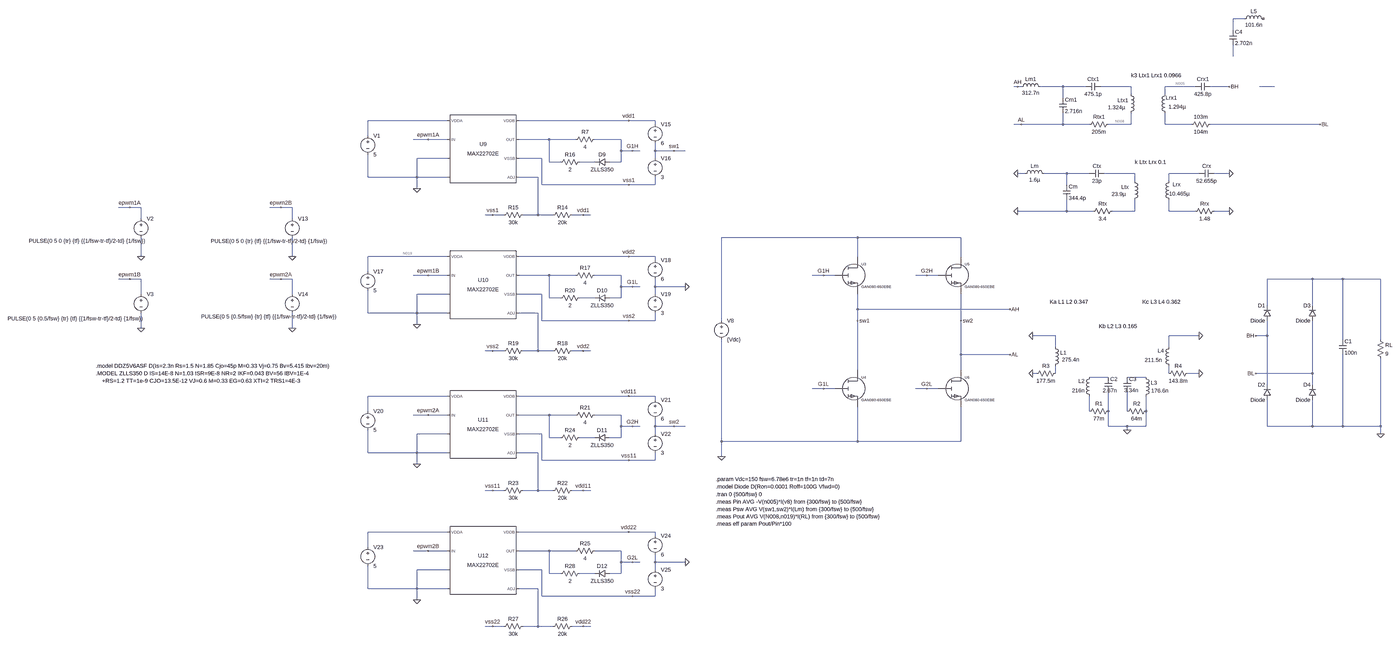
[diagram p0: schematic 1kW_LCCLS_sim.asc, whole sheet]
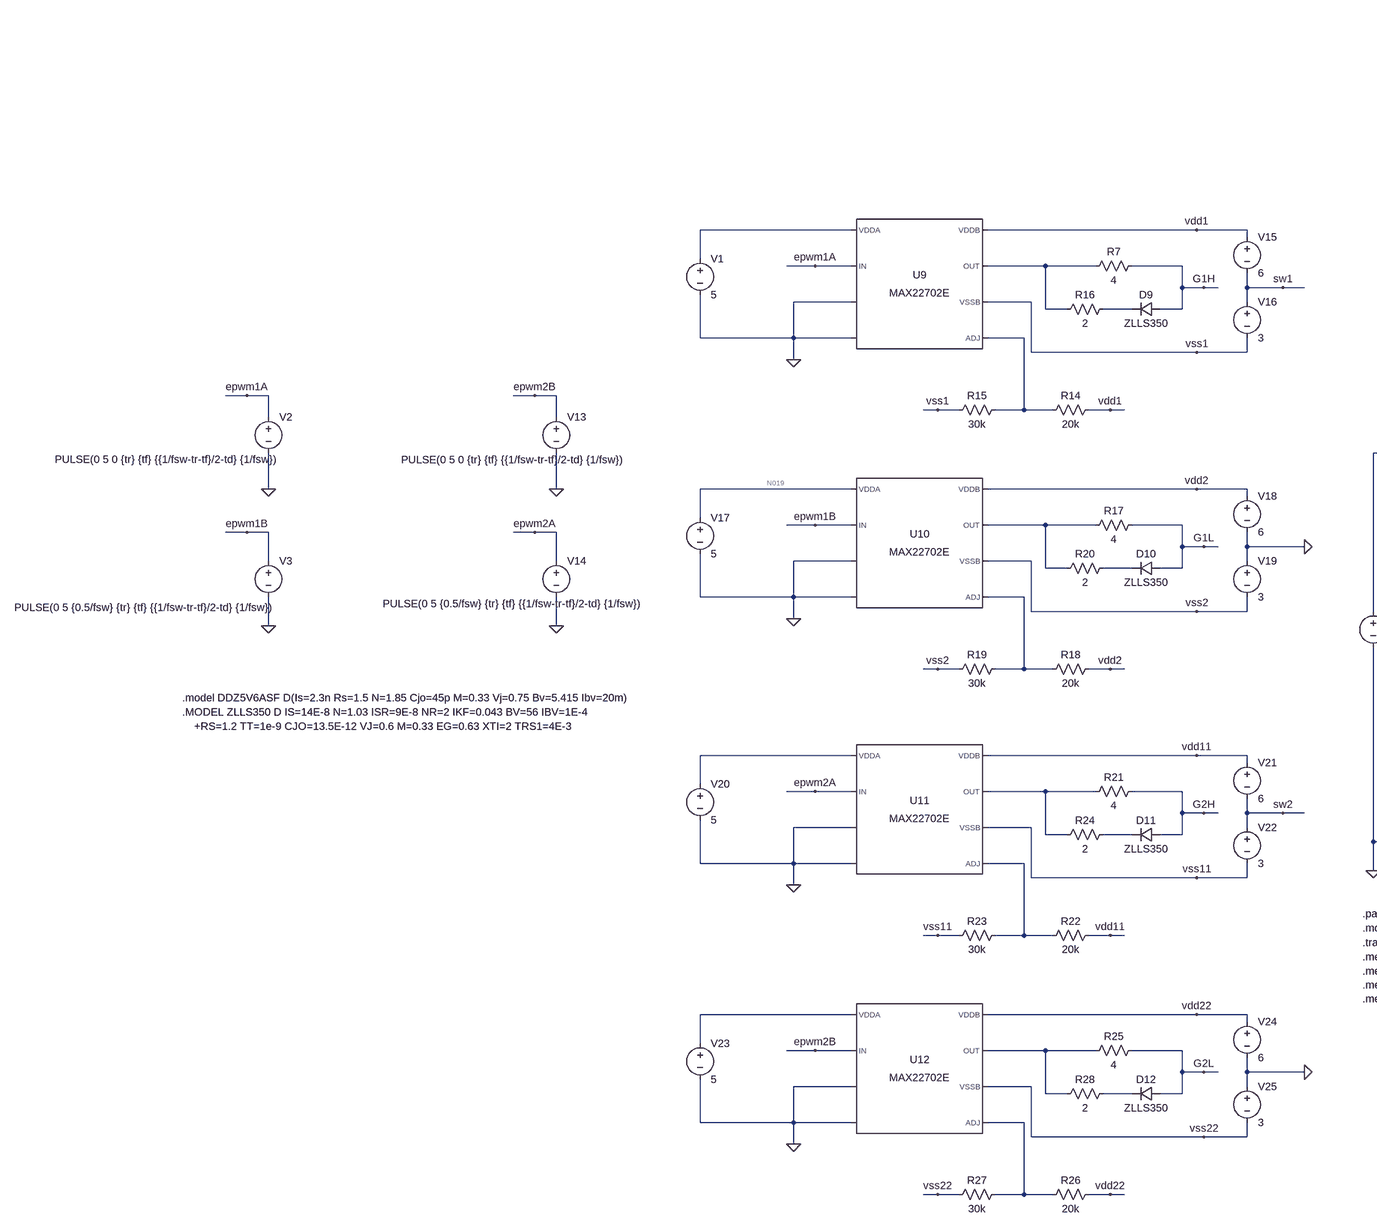
[diagram p1: schematic 1kW_LCCLS_sim.asc, part, row 1 of 1, column 1 of 2]
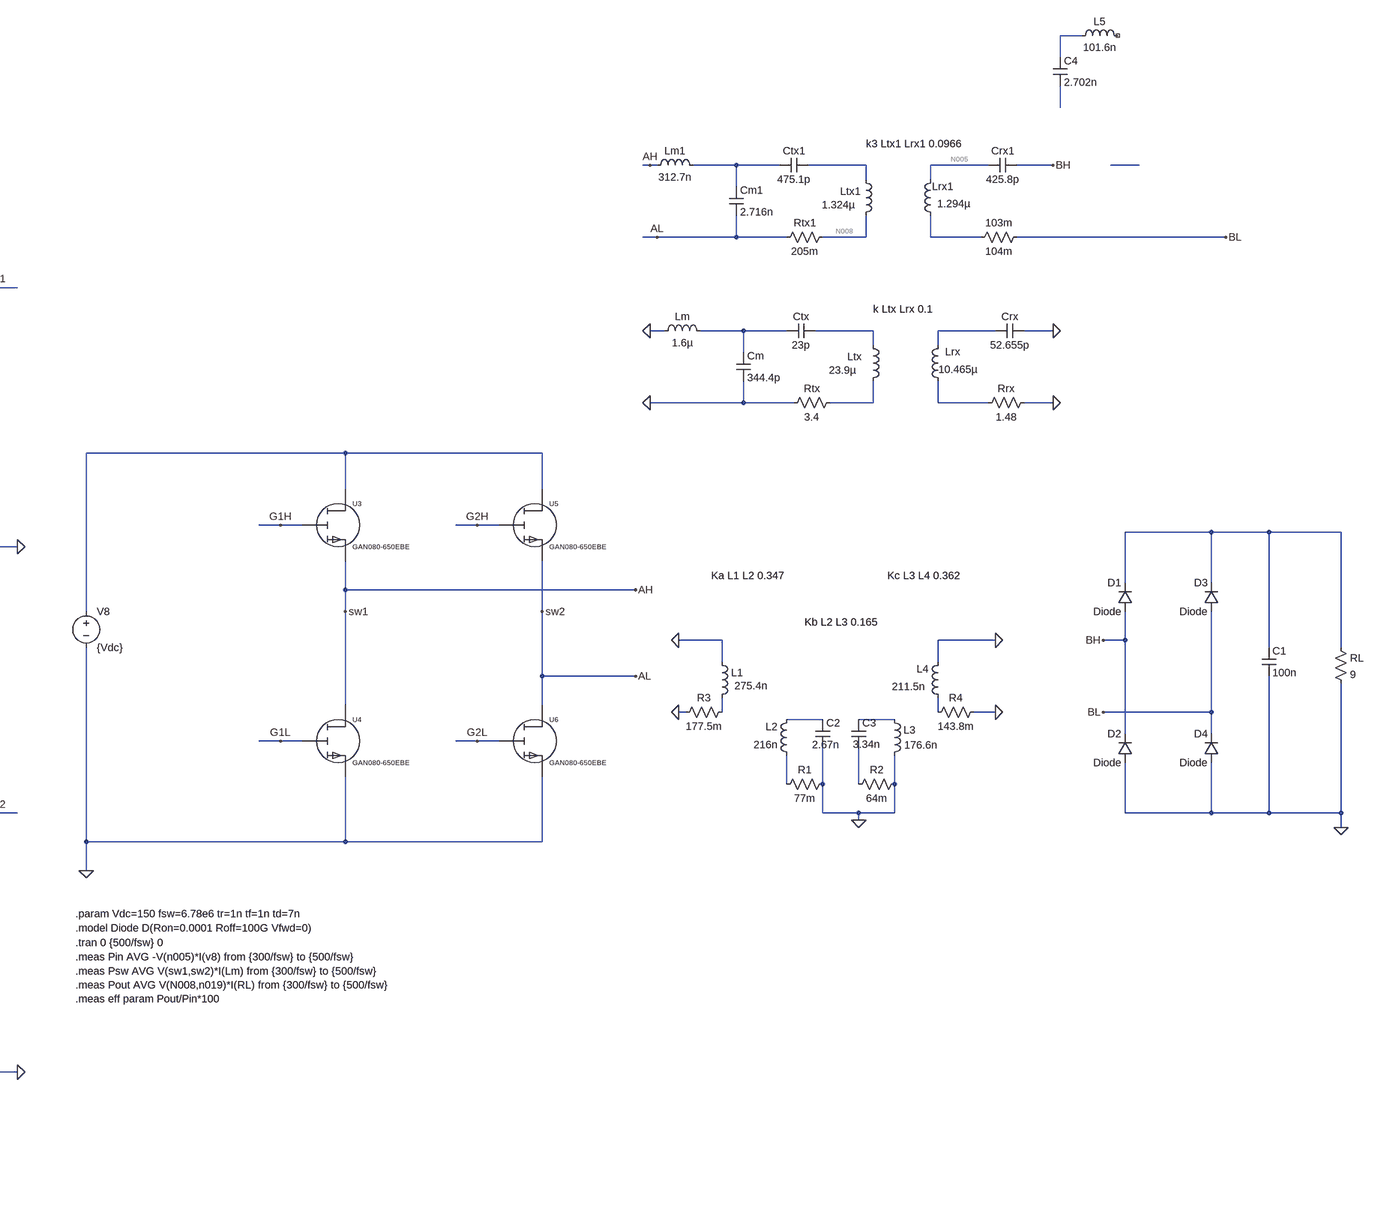
[diagram p2: schematic 1kW_LCCLS_sim.asc, part, row 1 of 1, column 2 of 2]
1kW_LCCLS_sim.asc, the LTspice schematic file:
Version 4.1
SHEET 1 2440 680
WIRE 1584 -4624 1536 -4624
WIRE 1536 -4576 1536 -4624
WIRE 1536 -4464 1536 -4512
WIRE 624 -4336 608 -4336
WIRE 640 -4336 624 -4336
WIRE 816 -4336 720 -4336
WIRE 912 -4336 816 -4336
WIRE 1104 -4336 976 -4336
WIRE 1376 -4336 1248 -4336
WIRE 1520 -4336 1440 -4336
WIRE 1712 -4336 1648 -4336
WIRE 1104 -4304 1104 -4336
WIRE 1248 -4304 1248 -4336
WIRE 816 -4288 816 -4336
WIRE -2160 -4192 -2496 -4192
WIRE -1392 -4192 -1856 -4192
WIRE -1280 -4192 -1392 -4192
WIRE -1280 -4176 -1280 -4192
WIRE 640 -4176 608 -4176
WIRE 816 -4176 816 -4224
WIRE 816 -4176 640 -4176
WIRE 928 -4176 816 -4176
WIRE 1104 -4176 1104 -4224
WIRE 1104 -4176 1008 -4176
WIRE 1248 -4176 1248 -4224
WIRE 1360 -4176 1248 -4176
WIRE 1904 -4176 1440 -4176
WIRE -2496 -4128 -2496 -4192
WIRE -2240 -4112 -2304 -4112
WIRE -2160 -4112 -2240 -4112
WIRE -1728 -4112 -1856 -4112
WIRE -1616 -4112 -1728 -4112
WIRE -1424 -4112 -1536 -4112
WIRE -1424 -4064 -1424 -4112
WIRE -1376 -4064 -1424 -4064
WIRE -1344 -4064 -1376 -4064
WIRE -1280 -4064 -1280 -4096
WIRE -1200 -4064 -1280 -4064
WIRE -1152 -4064 -1200 -4064
WIRE -2160 -4032 -2288 -4032
WIRE -1760 -4032 -1856 -4032
WIRE -1280 -4032 -1280 -4064
WIRE -1728 -4016 -1728 -4112
WIRE -1680 -4016 -1728 -4016
WIRE -1536 -4016 -1600 -4016
WIRE -1424 -4016 -1424 -4064
WIRE -1424 -4016 -1472 -4016
WIRE 656 -3968 624 -3968
WIRE 832 -3968 736 -3968
WIRE 928 -3968 832 -3968
WIRE 1120 -3968 992 -3968
WIRE 1392 -3968 1264 -3968
WIRE 1520 -3968 1456 -3968
WIRE -2496 -3952 -2496 -4048
WIRE -2288 -3952 -2288 -4032
WIRE -2288 -3952 -2496 -3952
WIRE -2160 -3952 -2288 -3952
WIRE -1776 -3952 -1856 -3952
WIRE 1120 -3936 1120 -3968
WIRE 1264 -3936 1264 -3968
WIRE -1760 -3920 -1760 -4032
WIRE -1392 -3920 -1760 -3920
WIRE -1280 -3920 -1280 -3952
WIRE -1280 -3920 -1392 -3920
WIRE 832 -3920 832 -3968
WIRE -2288 -3904 -2288 -3952
WIRE -3872 -3824 -3920 -3824
WIRE -3824 -3824 -3872 -3824
WIRE -3232 -3824 -3280 -3824
WIRE -3184 -3824 -3232 -3824
WIRE 832 -3808 832 -3856
WIRE 832 -3808 624 -3808
WIRE 944 -3808 832 -3808
WIRE 1120 -3808 1120 -3856
WIRE 1120 -3808 1024 -3808
WIRE 1264 -3808 1264 -3856
WIRE 1376 -3808 1264 -3808
WIRE 1520 -3808 1456 -3808
WIRE -1968 -3792 -2000 -3792
WIRE -1920 -3792 -1968 -3792
WIRE -1776 -3792 -1776 -3952
WIRE -1776 -3792 -1840 -3792
WIRE -1712 -3792 -1776 -3792
WIRE -1584 -3792 -1632 -3792
WIRE -1552 -3792 -1584 -3792
WIRE -3824 -3776 -3824 -3824
WIRE -3184 -3776 -3184 -3824
WIRE -160 -3696 -736 -3696
WIRE 384 -3696 -160 -3696
WIRE -3824 -3616 -3824 -3696
WIRE -3184 -3616 -3184 -3696
WIRE -2160 -3616 -2496 -3616
WIRE -1392 -3616 -1856 -3616
WIRE -1280 -3616 -1392 -3616
WIRE -160 -3616 -160 -3696
WIRE 384 -3616 384 -3696
WIRE -1280 -3600 -1280 -3616
WIRE -2496 -3552 -2496 -3616
WIRE -2240 -3536 -2304 -3536
WIRE -2160 -3536 -2240 -3536
WIRE -1728 -3536 -1856 -3536
WIRE -1616 -3536 -1728 -3536
WIRE -1424 -3536 -1536 -3536
WIRE -304 -3536 -352 -3536
WIRE -256 -3536 -304 -3536
WIRE 240 -3536 192 -3536
WIRE 288 -3536 240 -3536
WIRE -3872 -3520 -3920 -3520
WIRE -3824 -3520 -3872 -3520
WIRE -3232 -3520 -3280 -3520
WIRE -3184 -3520 -3232 -3520
WIRE 1872 -3520 1680 -3520
WIRE 2000 -3520 1872 -3520
WIRE 2160 -3520 2000 -3520
WIRE -1424 -3488 -1424 -3536
WIRE -1376 -3488 -1424 -3488
WIRE -1344 -3488 -1376 -3488
WIRE -1280 -3488 -1280 -3520
WIRE -1152 -3488 -1280 -3488
WIRE -3824 -3456 -3824 -3520
WIRE -3184 -3456 -3184 -3520
WIRE -2160 -3456 -2288 -3456
WIRE -1760 -3456 -1856 -3456
WIRE -1280 -3456 -1280 -3488
WIRE -1728 -3440 -1728 -3536
WIRE -1680 -3440 -1728 -3440
WIRE -1536 -3440 -1600 -3440
WIRE -1424 -3440 -1424 -3488
WIRE -1424 -3440 -1472 -3440
WIRE 1680 -3408 1680 -3520
WIRE 1872 -3408 1872 -3520
WIRE -160 -3392 -160 -3456
WIRE 592 -3392 -160 -3392
WIRE -2496 -3376 -2496 -3472
WIRE -2288 -3376 -2288 -3456
WIRE -2288 -3376 -2496 -3376
WIRE -2160 -3376 -2288 -3376
WIRE -1776 -3376 -1856 -3376
WIRE -1760 -3344 -1760 -3456
WIRE -1392 -3344 -1760 -3344
WIRE -1280 -3344 -1280 -3376
WIRE -1280 -3344 -1392 -3344
WIRE -736 -3344 -736 -3696
WIRE -160 -3344 -160 -3392
WIRE 384 -3344 384 -3456
WIRE -2288 -3328 -2288 -3376
WIRE -3824 -3312 -3824 -3376
WIRE -3184 -3312 -3184 -3376
WIRE 784 -3280 688 -3280
WIRE 1392 -3280 1264 -3280
WIRE 1680 -3280 1680 -3344
WIRE 1680 -3280 1632 -3280
WIRE 2000 -3264 2000 -3520
WIRE 2160 -3264 2160 -3520
WIRE 784 -3232 784 -3280
WIRE 1264 -3232 1264 -3280
WIRE -1968 -3216 -2000 -3216
WIRE -1920 -3216 -1968 -3216
WIRE -1776 -3216 -1776 -3376
WIRE -1776 -3216 -1840 -3216
WIRE -1712 -3216 -1776 -3216
WIRE -1584 -3216 -1632 -3216
WIRE -1552 -3216 -1584 -3216
WIRE 384 -3200 384 -3344
WIRE 592 -3200 384 -3200
WIRE -160 -3136 -160 -3344
WIRE 384 -3136 384 -3200
WIRE 704 -3120 688 -3120
WIRE 784 -3120 784 -3152
WIRE 1264 -3120 1264 -3152
WIRE 1392 -3120 1344 -3120
WIRE 1872 -3120 1872 -3344
WIRE 1872 -3120 1632 -3120
WIRE 1008 -3104 928 -3104
WIRE 1168 -3104 1088 -3104
WIRE 1680 -3072 1680 -3280
WIRE 1872 -3072 1872 -3120
WIRE -304 -3056 -352 -3056
WIRE -256 -3056 -304 -3056
WIRE 240 -3056 192 -3056
WIRE 288 -3056 240 -3056
WIRE -2160 -3024 -2496 -3024
WIRE -1392 -3024 -1856 -3024
WIRE -1280 -3024 -1392 -3024
WIRE -1280 -3008 -1280 -3024
WIRE -2496 -2960 -2496 -3024
WIRE 928 -2960 928 -3024
WIRE 1008 -2960 1008 -3040
WIRE 1088 -2960 1088 -3040
WIRE 1168 -2960 1168 -3024
WIRE -2240 -2944 -2304 -2944
WIRE -2160 -2944 -2240 -2944
WIRE -1728 -2944 -1856 -2944
WIRE -1616 -2944 -1728 -2944
WIRE -1424 -2944 -1536 -2944
WIRE -1424 -2896 -1424 -2944
WIRE -1376 -2896 -1424 -2896
WIRE -1344 -2896 -1376 -2896
WIRE -1280 -2896 -1280 -2928
WIRE -1200 -2896 -1280 -2896
WIRE -1152 -2896 -1200 -2896
WIRE 1008 -2896 1008 -2960
WIRE 1088 -2896 1008 -2896
WIRE 1168 -2896 1168 -2960
WIRE 1168 -2896 1088 -2896
WIRE 1680 -2896 1680 -3008
WIRE 1872 -2896 1872 -3008
WIRE 1872 -2896 1680 -2896
WIRE 2000 -2896 2000 -3200
WIRE 2000 -2896 1872 -2896
WIRE 2160 -2896 2160 -3184
WIRE 2160 -2896 2000 -2896
WIRE 1088 -2880 1088 -2896
WIRE -2160 -2864 -2288 -2864
WIRE -1760 -2864 -1856 -2864
WIRE -1280 -2864 -1280 -2896
WIRE 2160 -2864 2160 -2896
WIRE -1728 -2848 -1728 -2944
WIRE -1680 -2848 -1728 -2848
WIRE -1536 -2848 -1600 -2848
WIRE -1424 -2848 -1424 -2896
WIRE -1424 -2848 -1472 -2848
WIRE -736 -2832 -736 -3264
WIRE -160 -2832 -160 -2976
WIRE -160 -2832 -736 -2832
WIRE 384 -2832 384 -2976
WIRE 384 -2832 -160 -2832
WIRE -2496 -2784 -2496 -2880
WIRE -2288 -2784 -2288 -2864
WIRE -2288 -2784 -2496 -2784
WIRE -2160 -2784 -2288 -2784
WIRE -1776 -2784 -1856 -2784
WIRE -736 -2768 -736 -2832
WIRE -1760 -2752 -1760 -2864
WIRE -1392 -2752 -1760 -2752
WIRE -1280 -2752 -1280 -2784
WIRE -1280 -2752 -1392 -2752
WIRE -2288 -2736 -2288 -2784
WIRE -1968 -2624 -2000 -2624
WIRE -1920 -2624 -1968 -2624
WIRE -1776 -2624 -1776 -2784
WIRE -1776 -2624 -1840 -2624
WIRE -1712 -2624 -1776 -2624
WIRE -1584 -2624 -1632 -2624
WIRE -1552 -2624 -1584 -2624
WIRE -2160 -2448 -2496 -2448
WIRE -1392 -2448 -1856 -2448
WIRE -1280 -2448 -1392 -2448
WIRE -1280 -2432 -1280 -2448
WIRE -2496 -2384 -2496 -2448
WIRE -2240 -2368 -2304 -2368
WIRE -2160 -2368 -2240 -2368
WIRE -1728 -2368 -1856 -2368
WIRE -1616 -2368 -1728 -2368
WIRE -1424 -2368 -1536 -2368
WIRE -1424 -2320 -1424 -2368
WIRE -1376 -2320 -1424 -2320
WIRE -1344 -2320 -1376 -2320
WIRE -1280 -2320 -1280 -2352
WIRE -1152 -2320 -1280 -2320
WIRE -2160 -2288 -2288 -2288
WIRE -1760 -2288 -1856 -2288
WIRE -1280 -2288 -1280 -2320
WIRE -1728 -2272 -1728 -2368
WIRE -1680 -2272 -1728 -2272
WIRE -1536 -2272 -1600 -2272
WIRE -1424 -2272 -1424 -2320
WIRE -1424 -2272 -1472 -2272
WIRE -2496 -2208 -2496 -2304
WIRE -2288 -2208 -2288 -2288
WIRE -2288 -2208 -2496 -2208
WIRE -2160 -2208 -2288 -2208
WIRE -1776 -2208 -1856 -2208
WIRE -1760 -2176 -1760 -2288
WIRE -1376 -2176 -1760 -2176
WIRE -1280 -2176 -1280 -2208
WIRE -1280 -2176 -1376 -2176
WIRE -2288 -2160 -2288 -2208
WIRE -1968 -2048 -2000 -2048
WIRE -1920 -2048 -1968 -2048
WIRE -1776 -2048 -1776 -2208
WIRE -1776 -2048 -1840 -2048
WIRE -1712 -2048 -1776 -2048
WIRE -1584 -2048 -1632 -2048
WIRE -1552 -2048 -1584 -2048
FLAG -3872 -3824 epwm1A
FLAG -3872 -3520 epwm1B
FLAG -3824 -3616 0
FLAG -3824 -3312 0
FLAG -160 -3344 sw1
FLAG -736 -2768 0
FLAG -304 -3536 G1H
FLAG -304 -3056 G1L
FLAG 384 -3344 sw2
FLAG 240 -3536 G2H
FLAG 240 -3056 G2L
FLAG -3232 -3520 epwm2A
FLAG -3232 -3824 epwm2B
FLAG -3184 -3616 0
FLAG -3184 -3312 0
FLAG -1376 -4064 G1H
FLAG -2240 -4112 epwm1A
FLAG -2288 -3904 0
FLAG -1968 -3792 vss1
FLAG -1584 -3792 vdd1
FLAG -1392 -4192 vdd1
FLAG -1200 -4064 sw1
FLAG -1376 -3488 G1L
FLAG -2240 -3536 epwm1B
FLAG -2288 -3328 0
FLAG -1584 -3216 vdd2
FLAG -1392 -3616 vdd2
FLAG -1152 -3488 0
FLAG -1376 -2896 G2H
FLAG -2240 -2944 epwm2A
FLAG -2288 -2736 0
FLAG -1968 -2624 vss11
FLAG -1584 -2624 vdd11
FLAG -1392 -3024 vdd11
FLAG -1200 -2896 sw2
FLAG -1376 -2320 G2L
FLAG -2240 -2368 epwm2B
FLAG -2288 -2160 0
FLAG -1584 -2048 vdd22
FLAG -1392 -2448 vdd22
FLAG -1152 -2320 0
FLAG -1968 -2048 vss22
FLAG -1392 -3920 vss1
FLAG -1392 -3344 vss2
FLAG -1392 -2752 vss11
FLAG -1376 -2176 vss22
FLAG -1968 -3216 vss2
FLAG 2160 -2864 0
FLAG 1088 -2880 0
FLAG 592 -3392 AH
FLAG 624 -4336 AH
FLAG 592 -3200 AL
FLAG 640 -4176 AL
FLAG 1632 -3280 BH
FLAG 1520 -4336 BH
FLAG 1904 -4176 BL
FLAG 1632 -3120 BL
FLAG 1392 -3120 0
FLAG 1392 -3280 0
FLAG 688 -3120 0
FLAG 688 -3280 0
FLAG 1520 -3968 0
FLAG 1520 -3808 0
FLAG 624 -3808 0
FLAG 624 -3968 0
SYMBOL ind 640 -3952 R270
WINDOW 0 32 56 VTop 2
WINDOW 3 5 56 VBottom 2
SYMATTR InstName Lm
SYMATTR Value 1.6µ
SYMBOL cap 816 -3920 R0
SYMATTR InstName Cm
SYMATTR Value 344.4p
SYMBOL cap 992 -3984 R90
WINDOW 0 0 32 VBottom 2
WINDOW 3 32 32 VTop 2
SYMATTR InstName Ctx
SYMATTR Value 23p
SYMBOL ind 1104 -3952 R0
WINDOW 0 -41 42 Left 2
WINDOW 3 -82 72 Left 2
SYMATTR InstName Ltx
SYMATTR Value 23.9µ
SYMATTR Type ind
SYMBOL ind 1280 -3840 R180
WINDOW 0 -34 81 Left 2
WINDOW 3 -73 42 Left 2
SYMATTR InstName Lrx
SYMATTR Value 10.465µ
SYMATTR Type ind
SYMBOL cap 1456 -3984 R90
WINDOW 0 0 32 VBottom 2
WINDOW 3 32 32 VTop 2
SYMATTR InstName Crx
SYMATTR Value 52.655p
SYMBOL res 2144 -3280 R0
SYMATTR InstName RL
SYMATTR Value 9
SYMBOL res 1040 -3824 R90
WINDOW 0 0 56 VBottom 2
WINDOW 3 32 56 VTop 2
SYMATTR InstName Rtx
SYMATTR Value 3.4
SYMBOL res 1472 -3824 R90
WINDOW 0 0 56 VBottom 2
WINDOW 3 32 56 VTop 2
SYMATTR InstName Rrx
SYMATTR Value 1.48
SYMBOL voltage -3824 -3792 R0
WINDOW 123 0 0 Left 0
WINDOW 39 -273 152 Left 2
WINDOW 3 -475 110 Left 2
SYMATTR Value PULSE(0 5 0 {tr} {tf} {{1/fsw-tr-tf}/2-td} {1/fsw})
SYMATTR InstName V2
SYMBOL voltage -3824 -3472 R0
WINDOW 123 0 0 Left 0
WINDOW 39 -302 150 Left 2
WINDOW 3 -565 119 Left 2
SYMATTR Value PULSE(0 5 {0.5/fsw} {tr} {tf} {{1/fsw-tr-tf}/2-td} {1/fsw})
SYMATTR InstName V3
SYMBOL model\\GAN080-650EBE -176 -3536 R0
SYMATTR InstName U3
SYMBOL model\\GAN080-650EBE -176 -3056 R0
SYMATTR InstName U4
SYMBOL voltage -736 -3360 R0
WINDOW 123 0 0 Left 0
WINDOW 39 0 0 Left 0
SYMATTR InstName V8
SYMATTR Value {Vdc}
SYMBOL model\\GAN080-650EBE 368 -3536 R0
SYMATTR InstName U5
SYMBOL model\\GAN080-650EBE 368 -3056 R0
SYMATTR InstName U6
SYMBOL voltage -3184 -3792 R0
WINDOW 123 0 0 Left 0
WINDOW 39 -273 152 Left 2
WINDOW 3 -345 111 Left 2
SYMATTR Value PULSE(0 5 0 {tr} {tf} {{1/fsw-tr-tf}/2-td} {1/fsw})
SYMATTR InstName V13
SYMBOL voltage -3184 -3472 R0
WINDOW 123 0 0 Left 0
WINDOW 39 -302 150 Left 2
WINDOW 3 -386 111 Left 2
SYMATTR Value PULSE(0 5 {0.5/fsw} {tr} {tf} {{1/fsw-tr-tf}/2-td} {1/fsw})
SYMATTR InstName V14
SYMBOL PowerProducts\\MAX22702E -2016 -4112 R0
SYMATTR InstName U9
SYMBOL diode -1472 -4032 R90
WINDOW 0 0 32 VBottom 2
WINDOW 3 32 32 VTop 2
SYMATTR InstName D9
SYMATTR Value ZLLS350
SYMBOL res -1520 -4128 R90
WINDOW 0 0 56 VBottom 2
WINDOW 3 32 56 VTop 2
SYMATTR InstName R7
SYMATTR Value 4
SYMBOL voltage -2496 -4144 R0
WINDOW 123 0 0 Left 0
WINDOW 39 0 0 Left 0
SYMATTR InstName V1
SYMATTR Value 5
SYMBOL res -1616 -3808 R90
WINDOW 0 0 56 VBottom 2
WINDOW 3 32 56 VTop 2
SYMATTR InstName R14
SYMATTR Value 20k
SYMBOL res -1824 -3808 R90
WINDOW 0 0 56 VBottom 2
WINDOW 3 32 56 VTop 2
SYMATTR InstName R15
SYMATTR Value 30k
SYMBOL voltage -1280 -4192 R0
WINDOW 123 0 0 Left 0
WINDOW 39 0 0 Left 0
SYMATTR InstName V15
SYMATTR Value 6
SYMBOL res -1584 -4032 R90
WINDOW 0 0 56 VBottom 2
WINDOW 3 32 56 VTop 2
SYMATTR InstName R16
SYMATTR Value 2
SYMBOL voltage -1280 -4048 R0
WINDOW 123 0 0 Left 0
WINDOW 39 0 0 Left 0
SYMATTR InstName V16
SYMATTR Value 3
SYMBOL PowerProducts\\MAX22702E -2016 -3536 R0
SYMATTR InstName U10
SYMBOL diode -1472 -3456 R90
WINDOW 0 0 32 VBottom 2
WINDOW 3 32 32 VTop 2
SYMATTR InstName D10
SYMATTR Value ZLLS350
SYMBOL res -1520 -3552 R90
WINDOW 0 0 56 VBottom 2
WINDOW 3 32 56 VTop 2
SYMATTR InstName R17
SYMATTR Value 4
SYMBOL voltage -2496 -3568 R0
WINDOW 123 0 0 Left 0
WINDOW 39 0 0 Left 0
SYMATTR InstName V17
SYMATTR Value 5
SYMBOL res -1616 -3232 R90
WINDOW 0 0 56 VBottom 2
WINDOW 3 32 56 VTop 2
SYMATTR InstName R18
SYMATTR Value 20k
SYMBOL res -1824 -3232 R90
WINDOW 0 0 56 VBottom 2
WINDOW 3 32 56 VTop 2
SYMATTR InstName R19
SYMATTR Value 30k
SYMBOL voltage -1280 -3616 R0
WINDOW 123 0 0 Left 0
WINDOW 39 0 0 Left 0
SYMATTR InstName V18
SYMATTR Value 6
SYMBOL res -1584 -3456 R90
WINDOW 0 0 56 VBottom 2
WINDOW 3 32 56 VTop 2
SYMATTR InstName R20
SYMATTR Value 2
SYMBOL voltage -1280 -3472 R0
WINDOW 123 0 0 Left 0
WINDOW 39 0 0 Left 0
SYMATTR InstName V19
SYMATTR Value 3
SYMBOL PowerProducts\\MAX22702E -2016 -2944 R0
SYMATTR InstName U11
SYMBOL diode -1472 -2864 R90
WINDOW 0 0 32 VBottom 2
WINDOW 3 32 32 VTop 2
SYMATTR InstName D11
SYMATTR Value ZLLS350
SYMBOL res -1520 -2960 R90
WINDOW 0 0 56 VBottom 2
WINDOW 3 32 56 VTop 2
SYMATTR InstName R21
SYMATTR Value 4
SYMBOL voltage -2496 -2976 R0
WINDOW 123 0 0 Left 0
WINDOW 39 0 0 Left 0
SYMATTR InstName V20
SYMATTR Value 5
SYMBOL res -1616 -2640 R90
WINDOW 0 0 56 VBottom 2
WINDOW 3 32 56 VTop 2
SYMATTR InstName R22
SYMATTR Value 20k
SYMBOL res -1824 -2640 R90
WINDOW 0 0 56 VBottom 2
WINDOW 3 32 56 VTop 2
SYMATTR InstName R23
SYMATTR Value 30k
SYMBOL voltage -1280 -3024 R0
WINDOW 123 0 0 Left 0
WINDOW 39 24 44 Left 2
SYMATTR InstName V21
SYMATTR Value 6
SYMBOL res -1584 -2864 R90
WINDOW 0 0 56 VBottom 2
WINDOW 3 32 56 VTop 2
SYMATTR InstName R24
SYMATTR Value 2
SYMBOL voltage -1280 -2880 R0
WINDOW 123 0 0 Left 0
WINDOW 39 24 44 Left 2
SYMATTR InstName V22
SYMATTR Value 3
SYMBOL PowerProducts\\MAX22702E -2016 -2368 R0
SYMATTR InstName U12
SYMBOL diode -1472 -2288 R90
WINDOW 0 0 32 VBottom 2
WINDOW 3 32 32 VTop 2
SYMATTR InstName D12
SYMATTR Value ZLLS350
SYMBOL res -1520 -2384 R90
WINDOW 0 0 56 VBottom 2
WINDOW 3 32 56 VTop 2
SYMATTR InstName R25
SYMATTR Value 4
SYMBOL voltage -2496 -2400 R0
WINDOW 123 0 0 Left 0
WINDOW 39 0 0 Left 0
SYMATTR InstName V23
SYMATTR Value 5
SYMBOL res -1616 -2064 R90
WINDOW 0 0 56 VBottom 2
WINDOW 3 32 56 VTop 2
SYMATTR InstName R26
SYMATTR Value 20k
SYMBOL res -1824 -2064 R90
WINDOW 0 0 56 VBottom 2
WINDOW 3 32 56 VTop 2
SYMATTR InstName R27
SYMATTR Value 30k
SYMBOL voltage -1280 -2448 R0
WINDOW 123 0 0 Left 0
WINDOW 39 0 0 Left 0
SYMATTR InstName V24
SYMATTR Value 6
SYMBOL res -1584 -2288 R90
WINDOW 0 0 56 VBottom 2
WINDOW 3 32 56 VTop 2
SYMATTR InstName R28
SYMATTR Value 2
SYMBOL voltage -1280 -2304 R0
WINDOW 123 0 0 Left 0
WINDOW 39 0 0 Left 0
SYMATTR InstName V25
SYMATTR Value 3
SYMBOL diode 1696 -3344 R180
WINDOW 0 24 64 Left 2
WINDOW 3 24 0 Left 2
SYMATTR InstName D1
SYMATTR Value Diode
SYMBOL diode 1696 -3008 R180
WINDOW 0 24 64 Left 2
WINDOW 3 24 0 Left 2
SYMATTR InstName D2
SYMATTR Value Diode
SYMBOL diode 1888 -3344 R180
WINDOW 0 24 64 Left 2
WINDOW 3 24 0 Left 2
SYMATTR InstName D3
SYMATTR Value Diode
SYMBOL diode 1888 -3008 R180
WINDOW 0 24 64 Left 2
WINDOW 3 24 0 Left 2
SYMATTR InstName D4
SYMATTR Value Diode
SYMBOL cap 1984 -3264 R0
SYMATTR InstName C1
SYMATTR Value 100n
SYMBOL ind 768 -3248 R0
WINDOW 3 44 69 Left 2
SYMATTR Value 275.4n
SYMATTR InstName L1
SYMATTR Type ind
SYMATTR SpiceLine Rser=1m
SYMBOL ind 944 -3008 R180
WINDOW 0 36 80 Left 2
WINDOW 3 36 40 Left 2
SYMATTR InstName L2
SYMATTR Value 216n
SYMATTR Type ind
SYMATTR SpiceLine Rser=1m
SYMBOL ind 1152 -3120 R0
WINDOW 3 37 73 Left 2
SYMATTR Value 176.6n
SYMATTR InstName L3
SYMATTR Type ind
SYMATTR SpiceLine Rser=1m
SYMBOL ind 1280 -3136 R180
WINDOW 0 36 80 Left 2
WINDOW 3 44 41 Left 2
SYMATTR InstName L4
SYMATTR Value 211.5n
SYMATTR Type ind
SYMATTR SpiceLine Rser=1m
SYMBOL cap 992 -3104 R0
WINDOW 3 -8 56 Left 2
SYMATTR Value 2.67n
SYMATTR InstName C2
SYMBOL cap 1072 -3104 R0
WINDOW 3 3 55 Left 2
SYMATTR Value 3.34n
SYMATTR InstName C3
SYMBOL res 912 -2944 R270
WINDOW 0 32 56 VTop 2
WINDOW 3 0 56 VBottom 2
SYMATTR InstName R1
SYMATTR Value 77m
SYMBOL res 1184 -2976 R90
WINDOW 0 0 56 VBottom 2
WINDOW 3 32 56 VTop 2
SYMATTR InstName R2
SYMATTR Value 64m
SYMBOL res 800 -3136 R90
WINDOW 0 0 56 VBottom 2
WINDOW 3 32 56 VTop 2
SYMATTR InstName R3
SYMATTR Value 177.5m
SYMBOL res 1360 -3136 R90
WINDOW 0 0 56 VBottom 2
WINDOW 3 32 56 VTop 2
SYMATTR InstName R4
SYMATTR Value 143.8m
SYMBOL ind 624 -4320 R270
WINDOW 0 32 56 VTop 2
WINDOW 3 5 56 VBottom 2
SYMATTR InstName Lm1
SYMATTR Value 312.7n
SYMATTR SpiceLine Rser=1m
SYMBOL cap 800 -4288 R0
SYMATTR InstName Cm1
SYMATTR Value 2.716n
SYMBOL cap 976 -4352 R90
WINDOW 0 0 32 VBottom 2
WINDOW 3 32 32 VTop 2
SYMATTR InstName Ctx1
SYMATTR Value 475.1p
SYMBOL ind 1088 -4320 R0
WINDOW 0 -41 42 Left 2
WINDOW 3 -82 72 Left 2
SYMATTR InstName Ltx1
SYMATTR Value 1.324µ
SYMATTR Type ind
SYMATTR SpiceLine Rser=1m
SYMBOL ind 1264 -4208 R180
WINDOW 0 -34 81 Left 2
WINDOW 3 -73 42 Left 2
SYMATTR InstName Lrx1
SYMATTR Value 1.294µ
SYMATTR Type ind
SYMATTR SpiceLine Rser=1m
SYMBOL cap 1440 -4352 R90
WINDOW 0 0 32 VBottom 2
WINDOW 3 32 32 VTop 2
SYMATTR InstName Crx1
SYMATTR Value 425.8p
SYMBOL res 1024 -4192 R90
WINDOW 0 0 56 VBottom 2
WINDOW 3 32 56 VTop 2
SYMATTR InstName Rtx1
SYMATTR Value 205m
SYMBOL res 1456 -4192 R90
WINDOW 0 0 56 VBottom 2
WINDOW 3 32 56 VTop 2
SYMATTR InstName 103m
SYMATTR Value 104m
SYMBOL cap 1520 -4576 R0
SYMATTR InstName C4
SYMATTR Value 2.702n
SYMBOL ind 1568 -4608 R270
WINDOW 0 32 56 VTop 2
WINDOW 3 5 56 VBottom 2
SYMATTR InstName L5
SYMATTR Value 101.6n
SYMATTR SpiceLine Rser=1m
TEXT 1120 -4016 Left 2 !k Ltx Lrx 0.1
TEXT -4016 -3120 Left 2 !.MODEL ZLLS350 D IS=14E-8 N=1.03 ISR=9E-8 NR=2 IKF=0.043 BV=56 IBV=1E-4\n    +RS=1.2 TT=1e-9 CJO=13.5E-12 VJ=0.6 M=0.33 EG=0.63 XTI=2 TRS1=4E-3
TEXT -4016 -3152 Left 2 !.model DDZ5V6ASF D(Is=2.3n Rs=1.5 N=1.85 Cjo=45p M=0.33 Vj=0.75 Bv=5.415 Ibv=20m)
TEXT -760 -2672 Left 2 !.param Vdc=150 fsw=6.78e6 tr=1n tf=1n td=7n
TEXT -760 -2608 Left 2 !.tran 0 {500/fsw} 0
TEXT -760 -2576 Left 2 !.meas Pin AVG -V(n005)*I(v8) from {300/fsw} to {500/fsw}\n.meas Psw AVG V(sw1,sw2)*I(Lm) from {300/fsw} to {500/fsw}\n.meas Pout AVG V(N008,n019)*I(RL) from {300/fsw} to {500/fsw}\n.meas eff param Pout/Pin*100
TEXT -760 -2640 Left 2 !.model Diode D(Ron=0.0001 Roff=100G Vfwd=0)
TEXT 760 -3424 Left 2 !Ka L1 L2 0.347
TEXT 968 -3320 Left 2 !Kb L2 L3 0.165
TEXT 1152 -3424 Left 2 !Kc L3 L4 0.362
TEXT 1104 -4384 Left 2 !k3 Ltx1 Lrx1 0.0966

The netlist it stands for:
* 1kW_LCCLS_sim.asc
Lm 0 N012 1.6µ
Cm N012 0 344.4p
Ctx N013 N012 23p
Ltx N013 N016 23.9µ
Lrx N017 N014 10.465µ
Crx 0 N014 52.655p
RL N021 0 9
Rtx N016 0 3.4
Rrx 0 N017 1.48
V2 epwm1A 0 PULSE(0 5 0 {tr} {tf} {{1/fsw-tr-tf}/2-td} {1/fsw})
V3 epwm1B 0 PULSE(0 5 {0.5/fsw} {tr} {tf} {{1/fsw-tr-tf}/2-td} {1/fsw})
X§U3 N018 G1H AH GAN080-650EBE  ; pins Drain Gate Source
X§U4 AH G1L 0 GAN080-650EBE  ; pins Drain Gate Source
V8 N018 0 {Vdc}
X§U5 N018 G2H AL GAN080-650EBE  ; pins Drain Gate Source
X§U6 AL G2L 0 GAN080-650EBE  ; pins Drain Gate Source
V13 epwm2B 0 PULSE(0 5 0 {tr} {tf} {{1/fsw-tr-tf}/2-td} {1/fsw})
V14 epwm2A 0 PULSE(0 5 {0.5/fsw} {tr} {tf} {{1/fsw-tr-tf}/2-td} {1/fsw})
X§U9 N007 epwm1A 0 0 vdd1 N010 N015 vss1 MAX22702E  ; pins VDDA IN ? ? VDDB OUT ADJ VSSB
D9 G1H N011 ZLLS350
R7 G1H N010 4
V1 N007 0 5
R14 vdd1 N015 20k
R15 N015 vss1 30k
V15 vdd1 AH 6
R16 N011 N010 2
V16 AH vss1 3
X§U10 N019 epwm1B 0 0 vdd2 N020 N023 vss2 MAX22702E  ; pins VDDA IN ? ? VDDB OUT ADJ VSSB
D10 G1L N022 ZLLS350
R17 G1L N020 4
V17 N019 0 5
R18 vdd2 N023 20k
R19 N023 vss2 30k
V18 vdd2 0 6
R20 N022 N020 2
V19 0 vss2 3
X§U11 N028 epwm2A 0 0 vdd11 N031 N033 vss11 MAX22702E  ; pins VDDA IN ? ? VDDB OUT ADJ VSSB
D11 G2H N032 ZLLS350
R21 G2H N031 4
V20 N028 0 5
R22 vdd11 N033 20k
R23 N033 vss11 30k
V21 vdd11 AL 6
R24 N032 N031 2
V22 AL vss11 3
X§U12 N034 epwm2B 0 0 vdd22 N035 N037 vss22 MAX22702E  ; pins VDDA IN ? ? VDDB OUT ADJ VSSB
D12 G2L N036 ZLLS350
R25 G2L N035 4
V23 N034 0 5
R26 vdd22 N037 20k
R27 N037 vss22 30k
V24 vdd22 0 6
R28 N036 N035 2
V25 0 vss22 3
D1 BH N021 Diode
D2 0 BH Diode
D3 BL N021 Diode
D4 0 BL Diode
C1 N021 0 100n
L1 0 N024 275.4n Rser=1m
L2 N029 N026 216n Rser=1m
L3 N027 0 176.6n Rser=1m
L4 N025 0 211.5n Rser=1m
C2 N026 0 2.67n
C3 N027 N030 3.34n
R1 N029 0 77m
R2 0 N030 64m
R3 N024 0 177.5m
R4 0 N025 143.8m
Lm1 AH N003 312.7n Rser=1m
Cm1 N003 AL 2.716n
Ctx1 N004 N003 475.1p
Ltx1 N004 N008 1.324µ Rser=1m
Lrx1 N009 N005 1.294µ Rser=1m
Crx1 BH N005 425.8p
Rtx1 N008 AL 205m
R§103m BL N009 104m
C4 N001 N002 2.702n
L5 N001 NC_01 101.6n Rser=1m
.model D D
.lib standard.dio
k Ltx Lrx 0.1
.MODEL ZLLS350 D IS=14E-8 N=1.03 ISR=9E-8 NR=2 IKF=0.043 BV=56 IBV=1E-4
    +RS=1.2 TT=1e-9 CJO=13.5E-12 VJ=0.6 M=0.33 EG=0.63 XTI=2 TRS1=4E-3
.model DDZ5V6ASF D(Is=2.3n Rs=1.5 N=1.85 Cjo=45p M=0.33 Vj=0.75 Bv=5.415 Ibv=20m)
.param Vdc=150 fsw=6.78e6 tr=1n tf=1n td=7n
.tran 0 {500/fsw} 0
.meas Pin AVG -V(n005)*I(v8) from {300/fsw} to {500/fsw}
.meas Psw AVG V(sw1,sw2)*I(Lm) from {300/fsw} to {500/fsw}
.meas Pout AVG V(N008,n019)*I(RL) from {300/fsw} to {500/fsw}
.meas eff param Pout/Pin*100
.model Diode D(Ron=0.0001 Roff=100G Vfwd=0)
Ka L1 L2 0.347
Kb L2 L3 0.165
Kc L3 L4 0.362
k3 Ltx1 Lrx1 0.0966
.lib GAN080-650EBE_LTspice.lib
.lib MAX22702E.sub
.backanno
.end